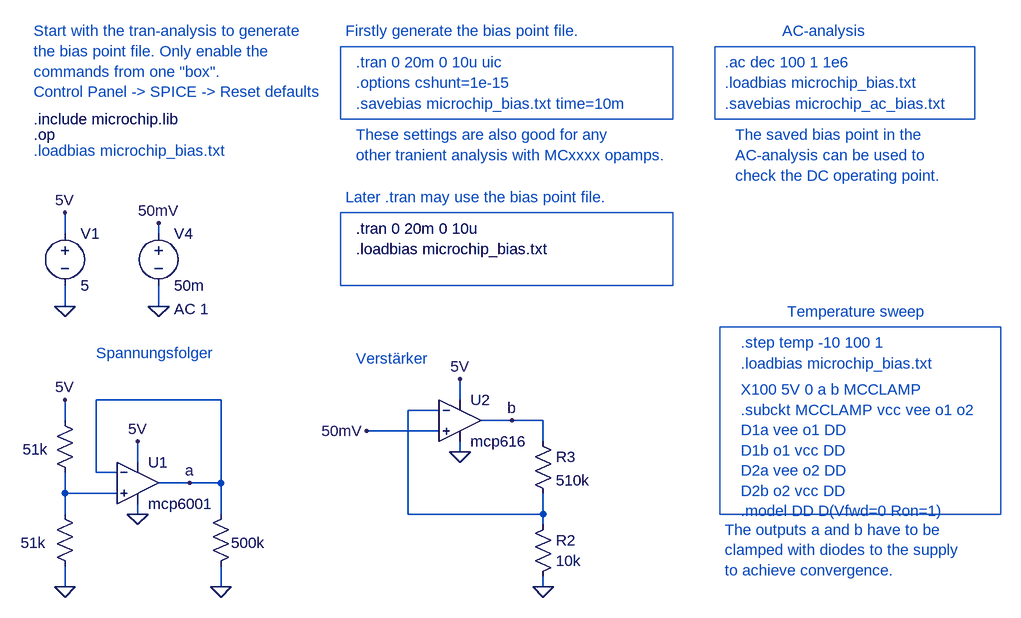
[diagram p0: schematic microchip_conv_later_tran.asc]
microchip_conv_later_tran.asc, the LTspice schematic file:
Version 4
SHEET 1 1536 984
WIRE -1440 -224 -1440 -256
WIRE -1296 -224 -1296 -240
WIRE -1440 -112 -1440 -144
WIRE -1296 -112 -1296 -144
WIRE -1200 32 -1392 32
WIRE -832 32 -832 0
WIRE -864 48 -912 48
WIRE -1440 64 -1440 32
WIRE -752 64 -800 64
WIRE -704 64 -752 64
WIRE -864 80 -976 80
WIRE -704 96 -704 64
WIRE -832 112 -832 96
WIRE -1328 128 -1328 96
WIRE -1392 144 -1392 32
WIRE -1360 144 -1392 144
WIRE -1248 160 -1296 160
WIRE -1200 160 -1200 32
WIRE -1200 160 -1248 160
WIRE -1440 176 -1440 144
WIRE -1360 176 -1440 176
WIRE -1440 208 -1440 176
WIRE -1328 208 -1328 192
WIRE -1200 208 -1200 160
WIRE -912 208 -912 48
WIRE -704 208 -704 176
WIRE -704 208 -912 208
WIRE -704 224 -704 208
WIRE -1440 320 -1440 288
WIRE -1200 320 -1200 288
WIRE -704 320 -704 304
FLAG -1440 -256 5V
FLAG -1296 -112 0
FLAG -1296 -240 50mV
FLAG -1440 320 0
FLAG -1328 96 5V
FLAG -832 0 5V
FLAG -704 320 0
FLAG -976 80 50mV
FLAG -832 112 0
FLAG -1440 32 5V
FLAG -1200 320 0
FLAG -1248 160 a
FLAG -752 64 b
FLAG -1440 -112 0
FLAG -1328 208 0
SYMBOL Opamps\\opamp2 -1328 96 R0
SYMATTR InstName U1
SYMATTR Value mcp6001
SYMBOL res -720 320 M180
WINDOW 0 36 72 Left 0
WINDOW 3 36 40 Left 0
SYMATTR InstName R2
SYMATTR Value 10k
SYMATTR SpiceLine tol=5
SYMBOL res -720 80 R0
SYMATTR InstName R3
SYMATTR Value 510k
SYMATTR SpiceLine tol=5
SYMBOL Opamps\\opamp2 -832 0 R0
SYMATTR InstName U2
SYMATTR Value mcp616
SYMBOL res -1456 48 R0
WINDOW 0 36 40 Invisible 0
WINDOW 3 -49 60 Left 0
SYMATTR InstName R9
SYMATTR Value 51k
SYMBOL res -1456 192 R0
WINDOW 0 36 40 Invisible 0
WINDOW 3 -52 60 Left 0
SYMATTR InstName R10
SYMATTR Value 51k
SYMBOL res -1184 192 M0
WINDOW 0 36 40 Invisible 0
WINDOW 3 -52 60 Left 0
SYMATTR InstName R1
SYMATTR Value 500k
SYMBOL voltage -1440 -240 R0
SYMATTR InstName V1
SYMATTR Value 5
SYMBOL voltage -1296 -240 R0
WINDOW 123 24 132 Left 0
WINDOW 39 0 0 Left 0
SYMATTR Value2 AC 1
SYMATTR InstName V4
SYMATTR Value 50m
TEXT -992 -32 Left 0 ;Verstärker
TEXT -1392 -40 Left 0 ;Spannungsfolger
TEXT -1488 -376 Left 0 !.op
TEXT -1488 -400 Left 0 !.include microchip.lib
TEXT -400 -56 Left 0 ;.step temp -10 100 1
TEXT -992 -488 Left 0 ;.tran 0 20m 0 10u uic
TEXT -992 -456 Left 0 ;.options cshunt=1e-15
TEXT -992 -424 Left 0 ;.savebias microchip_bias.txt time=10m
TEXT -400 -24 Left 0 ;.loadbias microchip_bias.txt
TEXT -400 16 Left 0 ;X100 5V 0 a b MCCLAMP\n.subckt MCCLAMP vcc vee o1 o2\nD1a vee o1 DD\nD1b o1 vcc DD\nD2a vee o2 DD\nD2b o2 vcc DD\n.model DD D(Vfwd=0 Ron=1)
TEXT -424 -488 Left 0 ;.ac dec 100 1 1e6
TEXT -424 -456 Left 0 ;.loadbias microchip_bias.txt
TEXT -1008 -536 Left 0 ;Firstly generate the bias point file.
TEXT -336 -536 Left 0 ;AC-analysis
TEXT -328 -104 Left 0 ;Temperature sweep
TEXT -1488 -536 Left 0 ;Start with the tran-analysis to generate\nthe bias point file. Only enable the \ncommands from one "box".\nControl Panel -> SPICE -> Reset defaults
TEXT -424 -424 Left 0 ;.savebias microchip_ac_bias.txt
TEXT -424 232 Left 0 ;The outputs a and b have to be \nclamped with diodes to the supply\nto achieve convergence.
TEXT -408 -376 Left 0 ;The saved bias point in the\nAC-analysis can be used to \ncheck the DC operating point.
TEXT -992 -376 Left 0 ;These settings are also good for any \nother tranient analysis with MCxxxx opamps.
TEXT -992 -232 Left 0 !.tran 0 20m 0 10u
TEXT -1008 -280 Left 0 ;Later .tran may use the bias point file.
TEXT -992 -200 Left 0 !.loadbias microchip_bias.txt
TEXT -1488 -352 Left 0 ;.loadbias microchip_bias.txt
RECTANGLE Normal -504 -400 -1016 -512
RECTANGLE Normal 0 208 -432 -80
RECTANGLE Normal -40 -400 -440 -512
RECTANGLE Normal -504 -144 -1016 -256

The netlist it stands for:
* microchip_conv_later_tran.asc
XU1 N002 a 5V 0 a mcp6001  ; pins In+ In- V+ V- OUT
R2 0 N001 10k tol=5
R3 b N001 510k tol=5
XU2 50mV N001 5V 0 b mcp616  ; pins In+ In- V+ V- OUT
R9 5V N002 51k
R10 N002 0 51k
R1 a 0 500k
V1 5V 0 5
V4 50mV 0 50m AC 1
* Verstärker
* Spannungsfolger
.op
.include microchip.lib
* .step temp -10 100 1
* .tran 0 20m 0 10u uic
* .options cshunt=1e-15
* .savebias microchip_bias.txt time=10m
* .loadbias microchip_bias.txt
* X100 5V 0 a b MCCLAMP
* .subckt MCCLAMP vcc vee o1 o2
* D1a vee o1 DD
* D1b o1 vcc DD
* D2a vee o2 DD
* D2b o2 vcc DD
* .model DD D(Vfwd=0 Ron=1)
* .ac dec 100 1 1e6
* .loadbias microchip_bias.txt
* Firstly generate the bias point file.
* AC-analysis
* Temperature sweep
* Start with the tran-analysis to generate
* the bias point file. Only enable the
* commands from one "box".
* Control Panel -> SPICE -> Reset defaults
* .savebias microchip_ac_bias.txt
* The outputs a and b have to be
* clamped with diodes to the supply
* to achieve convergence.
* The saved bias point in the
* AC-analysis can be used to
* check the DC operating point.
* These settings are also good for any
* other tranient analysis with MCxxxx opamps.
.tran 0 20m 0 10u
* Later .tran may use the bias point file.
.loadbias microchip_bias.txt
* .loadbias microchip_bias.txt
.backanno
.end